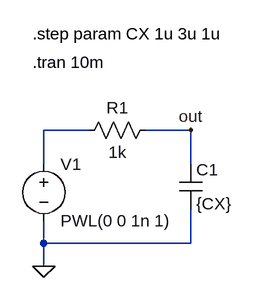
[diagram p0: schematic step_c.asc]
step_c.asc, the LTspice schematic file:
Version 4
SHEET 1 880 680
WIRE 96 160 32 160
WIRE 240 160 176 160
WIRE 32 208 32 160
WIRE 240 208 240 160
WIRE 32 320 32 288
WIRE 240 320 240 272
WIRE 240 320 32 320
WIRE 32 352 32 320
FLAG 32 352 0
FLAG 240 160 out
SYMBOL res 80 176 R270
WINDOW 0 32 56 VTop 0
WINDOW 3 0 56 VBottom 0
SYMATTR InstName R1
SYMATTR Value 1k
SYMBOL cap 224 208 R0
SYMATTR InstName C1
SYMATTR Value {CX}
SYMBOL voltage 32 192 R0
WINDOW 123 0 0 Left 0
WINDOW 39 0 0 Left 0
SYMATTR InstName V1
SYMATTR Value PWL(0 0 1n 1)
TEXT 16 24 Left 0 !.step param CX 1u 3u 1u
TEXT 16 64 Left 0 !.tran 10m

The netlist it stands for:
* step_c.asc
R1 N001 out 1k
C1 out 0 {CX}
V1 N001 0 PWL(0 0 1n 1)
.step param CX 1u 3u 1u
.tran 10m
.backanno
.end